# Altium schematic sheet Schematic.SchDoc
size A3
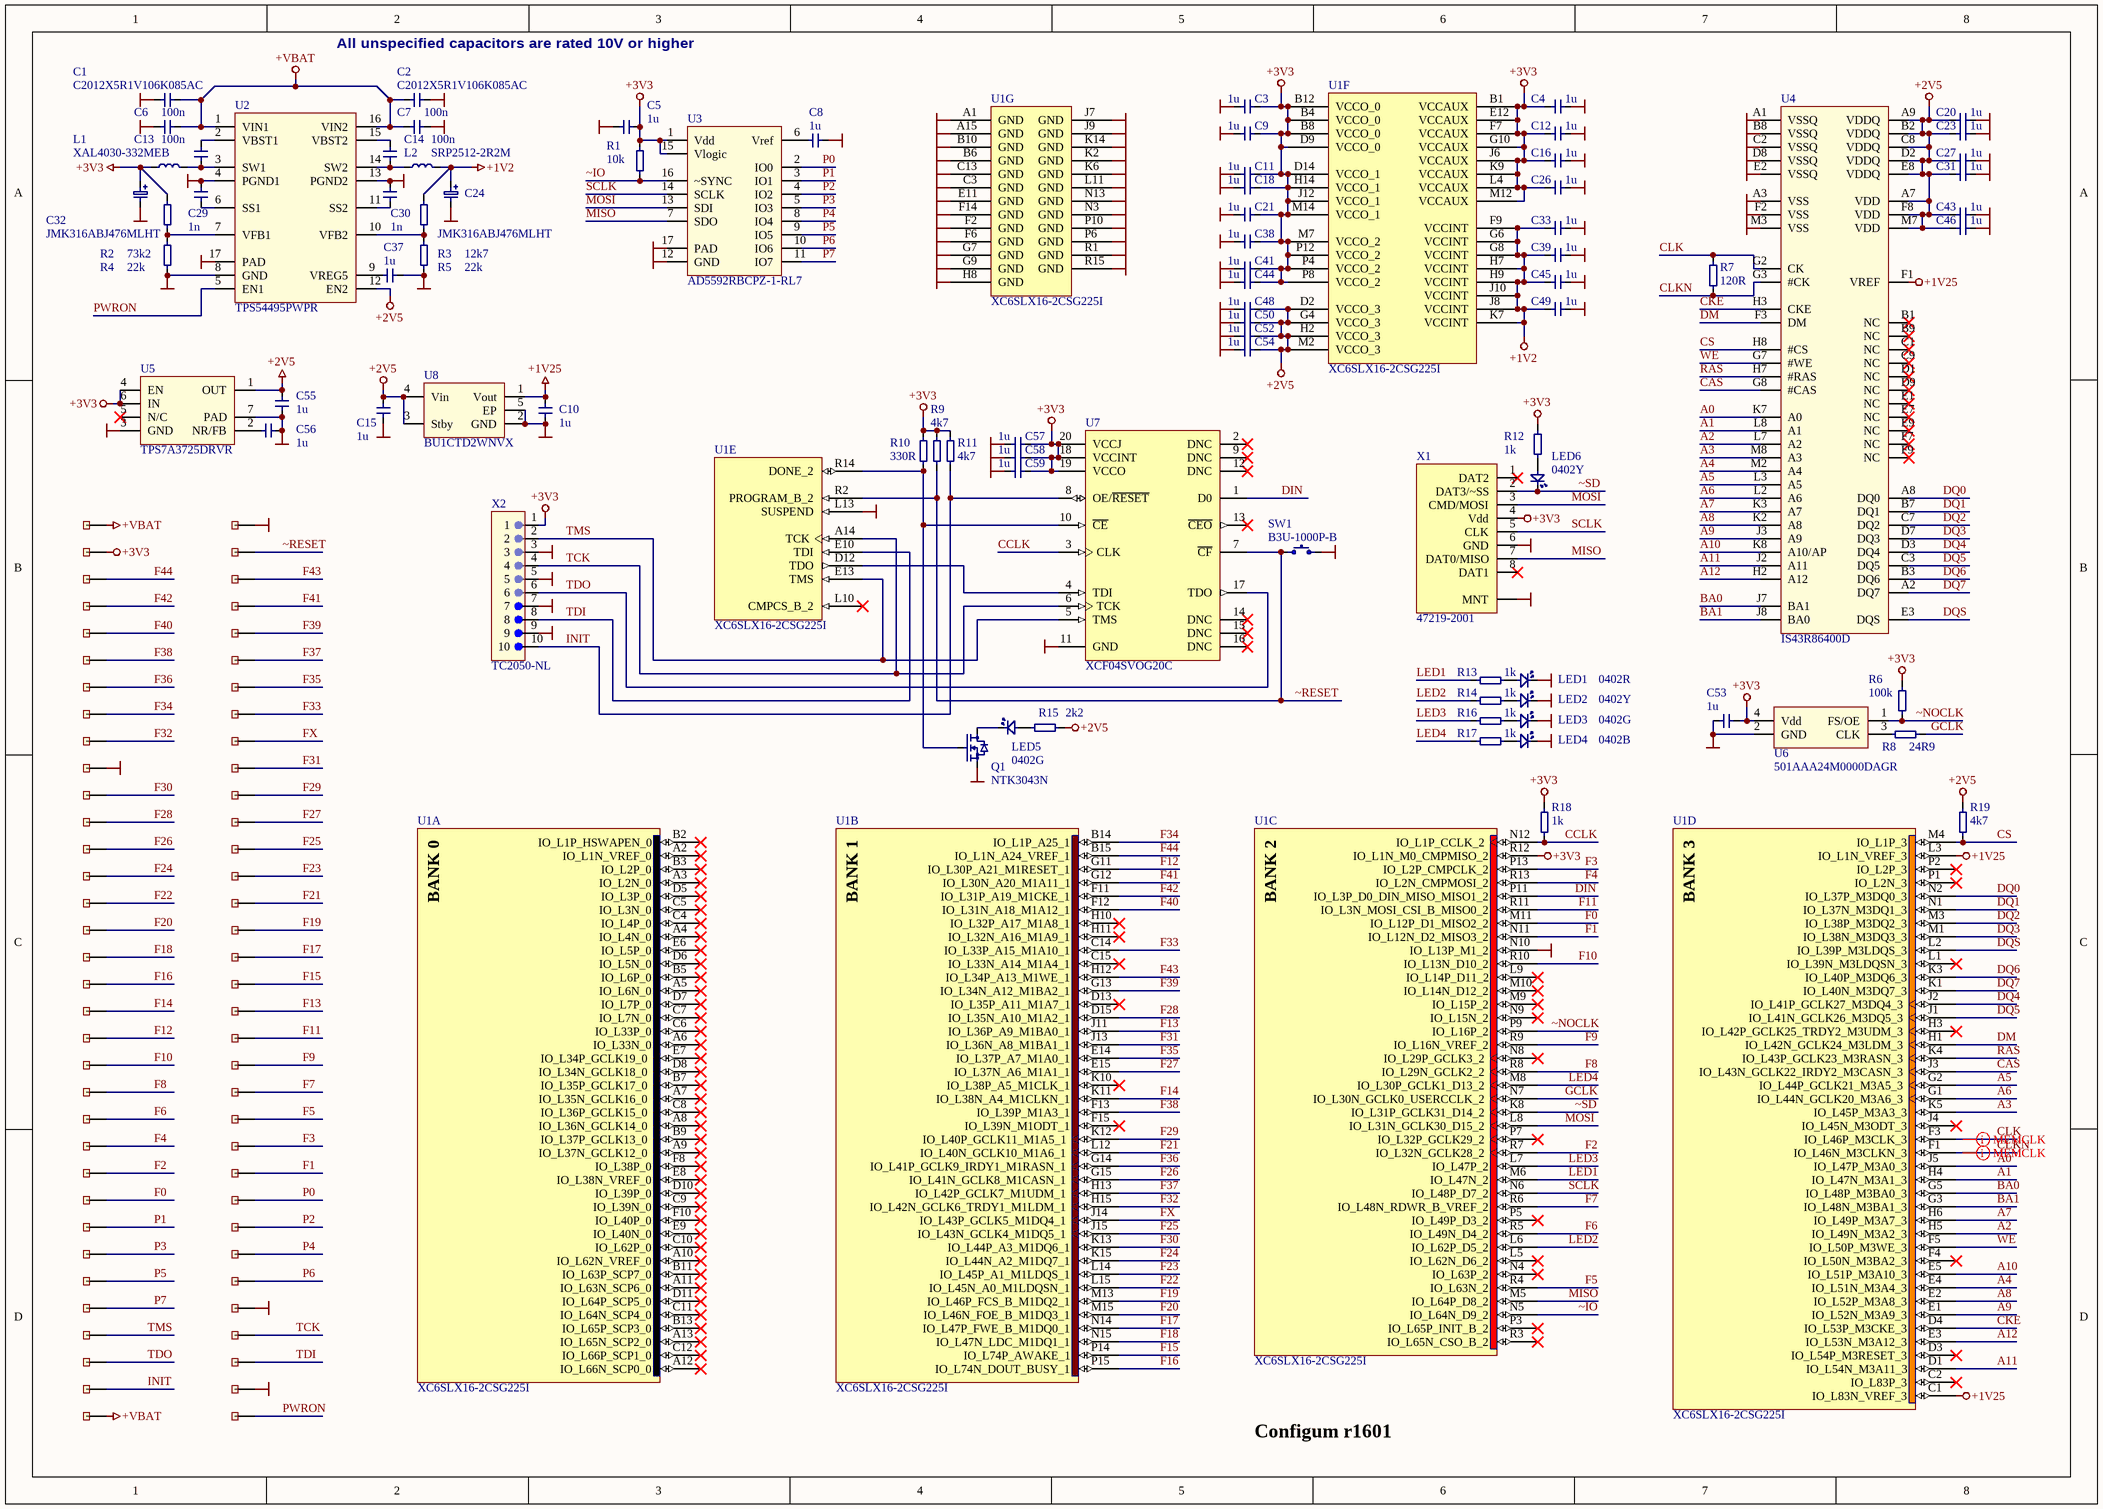
[diagram p0: Schematic.SchDoc]

## Parts
C1  C2012X5R1V106K085AC  [_0805]
C2  C2012X5R1V106K085AC  [_0805]
C3  1u  [_0402]
C4  1u  [_0402]
C5  1u  [_0402]
C6  100n  [_0402]
C7  100n  [_0402]
C8  1u  [_0402]
C9  1u  [_0402]
C10  1u  [_0402]
C11  1u  [_0402]
C12  1u  [_0402]
C13  100n  [_0402]
C14  100n  [_0402]
C15  1u  [_0402]
C16  1u  [_0402]
C18  1u  [_0402]
C20  1u  [_0402]
C21  1u  [_0402]
C23  1u  [_0402]
C24  JMK316ABJ476MLHT  [Case A (3216)]
C26  1u  [_0402]
C27  1u  [_0402]
C29  1n  [_0402]
C30  1n  [_0402]
C31  1u  [_0402]
C32  JMK316ABJ476MLHT  [Case A (3216)]
C33  1u  [_0402]
C37  1u  [_0402]
C38  1u  [_0402]
C39  1u  [_0402]
C41  1u  [_0402]
C43  1u  [_0402]
C44  1u  [_0402]
C45  1u  [_0402]
C46  1u  [_0402]
C48  1u  [_0402]
C49  1u  [_0402]
C50  1u  [_0402]
C52  1u  [_0402]
C53  1u  [_0402]
C54  1u  [_0402]
C55  1u  [_0402]
C56  1u  [_0402]
C57  1u  [_0402]
C58  1u  [_0402]
C59  1u  [_0402]
L1  XAL4030-332MEB  [IND_4X4]
L2  SRP2512-2R2M  [IND_2.5x2]
LED1  0402R  [_0402+]
LED2  0402Y  [_0402+]
LED3  0402G  [_0402+]
LED4  0402B  [_0402+]
LED5  0402G  [_0402+]
LED6  0402Y  [_0402+]
PIN1  Pin/Pad  [PLCC68 pin]  (value not drawn)  (no BOM)
PIN2  Pin/Pad  [PLCC68 pin]  (value not drawn)  (no BOM)
PIN3  Pin/Pad  [PLCC68 pin]  (value not drawn)  (no BOM)
PIN4  Pin/Pad  [PLCC68 pin]  (value not drawn)  (no BOM)
PIN5  Pin/Pad  [PLCC68 pin]  (value not drawn)  (no BOM)
PIN6  Pin/Pad  [PLCC68 pin]  (value not drawn)  (no BOM)
PIN7  Pin/Pad  [PLCC68 pin]  (value not drawn)  (no BOM)
PIN8  Pin/Pad  [PLCC68 pin]  (value not drawn)  (no BOM)
PIN9  Pin/Pad  [PLCC68 pin]  (value not drawn)  (no BOM)
PIN10  Pin/Pad  [PLCC68 pin]  (value not drawn)  (no BOM)
PIN11  Pin/Pad  [PLCC68 pin]  (value not drawn)  (no BOM)
PIN12  Pin/Pad  [PLCC68 pin]  (value not drawn)  (no BOM)
PIN13  Pin/Pad  [PLCC68 pin]  (value not drawn)  (no BOM)
PIN14  Pin/Pad  [PLCC68 pin]  (value not drawn)  (no BOM)
PIN15  Pin/Pad  [PLCC68 pin]  (value not drawn)  (no BOM)
PIN16  Pin/Pad  [PLCC68 pin]  (value not drawn)  (no BOM)
PIN17  Pin/Pad  [PLCC68 pin]  (value not drawn)  (no BOM)
PIN18  Pin/Pad  [PLCC68 pin]  (value not drawn)  (no BOM)
PIN19  Pin/Pad  [PLCC68 pin]  (value not drawn)  (no BOM)
PIN20  Pin/Pad  [PLCC68 pin]  (value not drawn)  (no BOM)
PIN21  Pin/Pad  [PLCC68 pin]  (value not drawn)  (no BOM)
PIN22  Pin/Pad  [PLCC68 pin]  (value not drawn)  (no BOM)
PIN23  Pin/Pad  [PLCC68 pin]  (value not drawn)  (no BOM)
PIN24  Pin/Pad  [PLCC68 pin]  (value not drawn)  (no BOM)
PIN25  Pin/Pad  [PLCC68 pin]  (value not drawn)  (no BOM)
PIN26  Pin/Pad  [PLCC68 pin]  (value not drawn)  (no BOM)
PIN27  Pin/Pad  [PLCC68 pin]  (value not drawn)  (no BOM)
PIN28  Pin/Pad  [PLCC68 pin]  (value not drawn)  (no BOM)
PIN29  Pin/Pad  [PLCC68 pin]  (value not drawn)  (no BOM)
PIN30  Pin/Pad  [PLCC68 pin]  (value not drawn)  (no BOM)
PIN31  Pin/Pad  [PLCC68 pin]  (value not drawn)  (no BOM)
PIN32  Pin/Pad  [PLCC68 pin]  (value not drawn)  (no BOM)
PIN33  Pin/Pad  [PLCC68 pin]  (value not drawn)  (no BOM)
PIN34  Pin/Pad  [PLCC68 pin]  (value not drawn)  (no BOM)
PIN35  Pin/Pad  [PLCC68 pin]  (value not drawn)  (no BOM)
PIN36  Pin/Pad  [PLCC68 pin]  (value not drawn)  (no BOM)
PIN37  Pin/Pad  [PLCC68 pin]  (value not drawn)  (no BOM)
PIN38  Pin/Pad  [PLCC68 pin]  (value not drawn)  (no BOM)
PIN39  Pin/Pad  [PLCC68 pin]  (value not drawn)  (no BOM)
PIN40  Pin/Pad  [PLCC68 pin]  (value not drawn)  (no BOM)
PIN41  Pin/Pad  [PLCC68 pin]  (value not drawn)  (no BOM)
PIN42  Pin/Pad  [PLCC68 pin]  (value not drawn)  (no BOM)
PIN43  Pin/Pad  [PLCC68 pin]  (value not drawn)  (no BOM)
PIN44  Pin/Pad  [PLCC68 pin]  (value not drawn)  (no BOM)
PIN45  Pin/Pad  [PLCC68 pin]  (value not drawn)  (no BOM)
PIN46  Pin/Pad  [PLCC68 pin]  (value not drawn)  (no BOM)
PIN47  Pin/Pad  [PLCC68 pin]  (value not drawn)  (no BOM)
PIN48  Pin/Pad  [PLCC68 pin]  (value not drawn)  (no BOM)
PIN49  Pin/Pad  [PLCC68 pin]  (value not drawn)  (no BOM)
PIN50  Pin/Pad  [PLCC68 pin]  (value not drawn)  (no BOM)
PIN51  Pin/Pad  [PLCC68 pin]  (value not drawn)  (no BOM)
PIN52  Pin/Pad  [PLCC68 pin]  (value not drawn)  (no BOM)
PIN53  Pin/Pad  [PLCC68 pin]  (value not drawn)  (no BOM)
PIN54  Pin/Pad  [PLCC68 pin]  (value not drawn)  (no BOM)
PIN55  Pin/Pad  [PLCC68 pin]  (value not drawn)  (no BOM)
PIN56  Pin/Pad  [PLCC68 pin]  (value not drawn)  (no BOM)
PIN57  Pin/Pad  [PLCC68 pin]  (value not drawn)  (no BOM)
PIN58  Pin/Pad  [PLCC68 pin]  (value not drawn)  (no BOM)
PIN59  Pin/Pad  [PLCC68 pin]  (value not drawn)  (no BOM)
PIN60  Pin/Pad  [PLCC68 pin]  (value not drawn)  (no BOM)
PIN61  Pin/Pad  [PLCC68 pin]  (value not drawn)  (no BOM)
PIN62  Pin/Pad  [PLCC68 pin]  (value not drawn)  (no BOM)
PIN63  Pin/Pad  [PLCC68 pin]  (value not drawn)  (no BOM)
PIN64  Pin/Pad  [PLCC68 pin]  (value not drawn)  (no BOM)
PIN65  Pin/Pad  [PLCC68 pin]  (value not drawn)  (no BOM)
PIN66  Pin/Pad  [PLCC68 pin]  (value not drawn)  (no BOM)
PIN67  Pin/Pad  [PLCC68 pin]  (value not drawn)  (no BOM)
PIN68  Pin/Pad  [PLCC68 pin]  (value not drawn)  (no BOM)
Q1  NTK3043N  [SC105-3]
R1  10k  [_0402]
R2  73k2  [_0402]
R3  12k7  [_0402]
R4  22k  [_0402]
R5  22k  [_0402]
R6  100k  [_0402]
R7  120R  [_0402]
R8  24R9  [_0402]
R9  4k7  [_0402]
R10  330R  [_0402]
R11  4k7  [_0402]
R12  1k  [_0402]
R13  1k  [_0402]
R14  1k  [_0402]
R15  2k2  [_0402]
R16  1k  [_0402]
R17  1k  [_0402]
R18  1k  [_0402]
R19  4k7  [_0402]
SW1  B3U-1000P-B  [B3U-1000P-B]
U1  XC6SLX16-2CSG225I  [CSG225]  (parts A,B,C,D,E,F,G of 7)
U2  TPS54495PWPR  [TSOP65P650X110_HS-16N]
U3  AD5592RBCPZ-1-RL7  [QFN50P300X300-16V4N]
U4  IS43R86400D  [BGA60C80P12X9_1300X800X120]
U5  TPS7A3725DRVR  [SON65P200x200_HS-6N]
U6  501AAA24M0000DAGR  [Osc 25x20 (4)]
U7  XCF04SVOG20C  [VOG20_L]
U8  BU1CTD2WNVX  [DFN65P100x100-4]
X1  47219-2001  [MOLEX_47219-2001]
X2  TC2050-NL  [TC2050-NL]  (no BOM)

## Nets
+1V2: C24.1 C33.1 C39.1 C45.1 C49.1 L2.1 R3.2 U1.F9(VCCINT) U1.G6(VCCINT) U1.G8(VCCINT) U1.H7(VCCINT) U1.H9(VCCINT) U1.J8(VCCINT) U1.J10(VCCINT) U1.K7(VCCINT)
+1V25: C10.2 U1.C1(IO_L83N_VREF_3) U1.L3(IO_L1N_VREF_3) U4.F1(VREF) U8.1(Vout)
+2V5: C15.2 C20.1 C23.1 C27.1 C31.1 C43.1 C46.1 C48.2 C50.2 C52.2 C54.2 C55.1 R15.2 R19.2 U1.D2(VCCO_3) U1.G4(VCCO_3) U1.H2(VCCO_3) U1.M2(VCCO_3) U2.12(EN2) U4.A7(VDD) U4.A9(VDDQ) U4.B2(VDDQ) U4.C8(VDDQ) U4.D2(VDDQ) U4.E8(VDDQ) U4.F8(VDD) U4.M7(VDD) U5.1(OUT) U8.3(Stby) U8.4(Vin)
+3V3: C3.2 C4.1 C5.2 C9.2 C11.2 C12.1 C16.1 C18.2 C21.2 C26.1 C32.1 C38.2 C41.2 C44.2 C53.1 C57.2 C58.2 C59.2 L1.1 PIN3.12 R1.1 R2.2 R6.1 R9.1 R10.1 R11.1 R12.1 R18.2 U1.B1(VCCAUX) U1.B4(VCCO_0) U1.B8(VCCO_0) U1.B12(VCCO_0) U1.D9(VCCO_0) U1.D14(VCCO_1) U1.E12(VCCAUX) U1.F7(VCCAUX) U1.G10(VCCAUX) U1.H14(VCCO_1) U1.J6(VCCAUX) U1.J12(VCCO_1) U1.K9(VCCAUX) U1.L4(VCCAUX) U1.M7(VCCO_2) U1.M12(VCCAUX) U1.M14(VCCO_1) U1.P4(VCCO_2) U1.P8(VCCO_2) U1.P12(VCCO_2) U1.R12(IO_L1N_M0_CMPMISO_2) U3.1(Vdd) U3.15(Vlogic) U5.4(EN) U5.6(IN) U6.4(Vdd) U7.18(VCCINT) U7.19(VCCO) U7.20(VCCJ) X1.4(Vdd) X2.1
+VBAT: C1.2 C2.1 C6.2 C7.1 PIN1.10 PIN67.8 U2.1(VIN1) U2.16(VIN2)
GND: C1.1 C2.2 C3.1 C4.2 C5.1 C6.1 C7.2 C8.2 C9.1 C10.1 C11.1 C12.2 C15.1 C16.2 C18.1 C20.2 C21.1 C23.2 C24.2 C26.2 C27.2 C29.1 C30.1 C31.2 C32.2 C33.2 C37.2 C38.1 C39.2 C41.1 C43.2 C44.1 C45.2 C46.2 C48.1 C49.2 C50.1 C52.1 C53.2 C54.1 C55.2 C56.1 C57.1 C58.1 C59.1 LED1.1 LED2.1 LED3.1 LED4.1 PIN2.11 PIN19.28 PIN60.1 PIN66.7 Q1.2(S) R4.1 R5.1 SW1.2 U1.A1(GND) U1.A15(GND) U1.B6(GND) U1.B10(GND) U1.C3(GND) U1.C13(GND) U1.E11(GND) U1.F2(GND) U1.F6(GND) U1.F14(GND) U1.G7(GND) U1.G9(GND) U1.H8(GND) U1.J7(GND) U1.J9(GND) U1.K2(GND) U1.K6(GND) U1.K14(GND) U1.L11(GND) U1.L13(SUSPEND) U1.N3(GND) U1.N10(IO_L13P_M1_2) U1.N13(GND) U1.P6(GND) U1.P10(GND) U1.R1(GND) U1.R15(GND) U2.4(PGND1) U2.8(GND) U2.13(PGND2) U2.17(PAD) U3.12(GND) U3.17(PAD) U4.A1(VSSQ) U4.A3(VSS) U4.B8(VSSQ) U4.C2(VSSQ) U4.D8(VSSQ) U4.E2(VSSQ) U4.F2(VSS) U4.M3(VSS) U5.3(GND) U5.7(PAD) U6.2(GND) U7.11(GND) U8.2(GND) U8.5(EP) X1.0(MNT) X1.6(GND) X2.3 X2.5 X2.7 X2.9
A0: U1.J5(IO_L47P_M3A0_3) U4.K7(A0)
A1: U1.H4(IO_L47N_M3A1_3) U4.L8(A1)
A2: U1.H5(IO_L49N_M3A2_3) U4.L7(A2)
A3: U1.K5(IO_L45P_M3A3_3) U4.M8(A3)
A4: U1.E4(IO_L51N_M3A4_3) U4.M2(A4)
A5: U1.G2(IO_L44P_GCLK21_M3A5_3) U4.L3(A5)
A6: U1.G1(IO_L44N_GCLK20_M3A6_3) U4.L2(A6)
A7: U1.H6(IO_L49P_M3A7_3) U4.K3(A7)
A8: U1.E2(IO_L52P_M3A8_3) U4.K2(A8)
A9: U1.E1(IO_L52N_M3A9_3) U4.J3(A9)
A10: U1.E5(IO_L51P_M3A10_3) U4.K8(A10/AP)
A11: U1.D1(IO_L54N_M3A11_3) U4.J2(A11)
A12: U1.E3(IO_L53N_M3A12_3) U4.H2(A12)
BA0: U1.G5(IO_L48P_M3BA0_3) U4.J7(BA1)
BA1: U1.G3(IO_L48N_M3BA1_3) U4.J8(BA0)
CAS: U1.J3(IO_L43N_GCLK22_IRDY2_M3CASN_3) U4.G8(#CAS)
CCLK: R18.1 U1.N12(IO_L1P_CCLK_2) U7.3(CLK)
CKE: U1.D4(IO_L53P_M3CKE_3) U4.H3(CKE)
CLK: R7.1 U1.F3(IO_L46P_M3CLK_3) U4.G2(CK)
CLKN: R7.2 U1.F1(IO_L46N_M3CLKN_3) U4.G3(#CK)
CS: R19.1 U1.M4(IO_L1P_3) U4.H8(#CS)
DIN: U1.P11(IO_L3P_D0_DIN_MISO_MISO1_2) U7.1(D0)
DM: U1.H1(IO_L42N_GCLK24_M3LDM_3) U4.F3(DM)
DQ0: U1.N2(IO_L37P_M3DQ0_3) U4.A8(DQ0)
DQ1: U1.N1(IO_L37N_M3DQ1_3) U4.B7(DQ1)
DQ2: U1.M3(IO_L38P_M3DQ2_3) U4.C7(DQ2)
DQ3: U1.M1(IO_L38N_M3DQ3_3) U4.D7(DQ3)
DQ4: U1.J2(IO_L41P_GCLK27_M3DQ4_3) U4.D3(DQ4)
DQ5: U1.J1(IO_L41N_GCLK26_M3DQ5_3) U4.C3(DQ5)
DQ6: U1.K3(IO_L40P_M3DQ6_3) U4.B3(DQ6)
DQ7: U1.K1(IO_L40N_M3DQ7_3) U4.A2(DQ7)
DQS: U1.L2(IO_L39P_M3LDQS_3) U4.E3(DQS)
F0: PIN51.60 U1.M11(IO_L12P_D1_MISO2_2)
F1: PIN50.59 U1.N11(IO_L12N_D2_MISO3_2)
F2: PIN49.58 U1.R7(IO_L32N_GCLK28_2)
F3: PIN48.57 U1.P13(IO_L2P_CMPCLK_2)
F4: PIN47.56 U1.R13(IO_L2N_CMPMOSI_2)
F5: PIN46.55 U1.R4(IO_L63N_2)
F6: PIN45.54 U1.R5(IO_L49N_D4_2)
F7: PIN44.53 U1.R6(IO_L48N_RDWR_B_VREF_2)
F8: PIN43.52 U1.R8(IO_L29N_GCLK2_2)
F9: PIN42.51 U1.R9(IO_L16N_VREF_2)
F10: PIN41.50 U1.R10(IO_L13N_D10_2)
F11: PIN40.49 U1.R11(IO_L3N_MOSI_CSI_B_MISO0_2)
F12: PIN39.48 U1.G11(IO_L30P_A21_M1RESET_1)
F13: PIN38.47 U1.J11(IO_L36P_A9_M1BA0_1)
F14: PIN37.46 U1.K11(IO_L38N_A4_M1CLKN_1)
F15: PIN36.45 U1.P14(IO_L74P_AWAKE_1)
F16: PIN35.44 U1.P15(IO_L74N_DOUT_BUSY_1)
F17: PIN34.43 U1.N14(IO_L47P_FWE_B_M1DQ0_1)
F18: PIN33.42 U1.N15(IO_L47N_LDC_M1DQ1_1)
F19: PIN32.41 U1.M13(IO_L46P_FCS_B_M1DQ2_1)
F20: PIN31.40 U1.M15(IO_L46N_FOE_B_M1DQ3_1)
F21: PIN30.39 U1.L12(IO_L40N_GCLK10_M1A6_1)
F22: PIN29.38 U1.L15(IO_L45N_A0_M1LDQSN_1)
F23: PIN28.37 U1.L14(IO_L45P_A1_M1LDQS_1)
F24: PIN27.36 U1.K15(IO_L44N_A2_M1DQ7_1)
F25: PIN26.35 U1.J15(IO_L43N_GCLK4_M1DQ5_1)
F26: PIN25.34 U1.G15(IO_L41N_GCLK8_M1CASN_1)
F27: PIN24.33 U1.E15(IO_L37N_A6_M1A1_1)
F28: PIN23.32 U1.D15(IO_L35N_A10_M1A2_1)
F29: PIN22.31 U1.K12(IO_L40P_GCLK11_M1A5_1)
F30: PIN21.30 U1.K13(IO_L44P_A3_M1DQ6_1)
F31: PIN20.29 U1.J13(IO_L36N_A8_M1BA1_1)
F32: PIN17.26 U1.H15(IO_L42N_GCLK6_TRDY1_M1LDM_1)
F33: PIN16.25 U1.C14(IO_L33P_A15_M1A10_1)
F34: PIN15.24 U1.B14(IO_L1P_A25_1)
F35: PIN14.23 U1.E14(IO_L37P_A7_M1A0_1)
F36: PIN13.22 U1.G14(IO_L41P_GCLK9_IRDY1_M1RASN_1)
F37: PIN12.21 U1.H13(IO_L42P_GCLK7_M1UDM_1)
F38: PIN11.20 U1.F13(IO_L39P_M1A3_1)
F39: PIN10.19 U1.G13(IO_L34N_A12_M1BA2_1)
F40: PIN9.18 U1.F12(IO_L31N_A18_M1A12_1)
F41: PIN8.17 U1.G12(IO_L30N_A20_M1A11_1)
F42: PIN7.16 U1.F11(IO_L31P_A19_M1CKE_1)
F43: PIN6.15 U1.H12(IO_L34P_A13_M1WE_1)
F44: PIN5.14 U1.B15(IO_L1N_A24_VREF_1)
FX: PIN18.27 U1.J14(IO_L43P_GCLK5_M1DQ4_1)
GCLK: R8.2 U1.N7(IO_L30N_GCLK0_USERCCLK_2)
INIT: PIN65.6 R11.2 U7.8(OE/~{RESET}) X2.10
LED1: R13.2 U1.M6(IO_L47N_2)
LED2: R14.2 U1.L6(IO_L62P_D5_2)
LED3: R16.2 U1.L7(IO_L47P_2)
LED4: R17.2 U1.M8(IO_L30P_GCLK1_D13_2)
MISO: U1.M5(IO_L64P_D8_2) U3.7(SDO) X1.7(DAT0/MISO)
MOSI: U1.L8(IO_L31N_GCLK30_D15_2) U3.13(SDI) X1.3(CMD/MOSI)
P0: PIN52.61 U3.2(IO0)
P1: PIN53.62 U3.3(IO1)
P2: PIN54.63 U3.4(IO2)
P3: PIN55.64 U3.5(IO3)
P4: PIN56.65 U3.8(IO4)
P5: PIN57.66 U3.9(IO5)
P6: PIN58.67 U3.10(IO6)
P7: PIN59.68 U3.11(IO7)
PWRON: PIN68.9 U2.5(EN1)
RAS: U1.K4(IO_L43P_GCLK23_M3RASN_3) U4.H7(#RAS)
SCLK: U1.N6(IO_L48P_D7_2) U3.14(SCLK) X1.5(CLK)
TCK: PIN62.3 U1.A14(TCK) U7.6(TCK) X2.4
TDI: PIN64.5 U1.E10(TDI) X2.8
TDO: PIN63.4 U7.17(TDO) X2.6
TMS: PIN61.2 U1.E13(TMS) U7.5(TMS) X2.2
WE: U1.F5(IO_L50P_M3WE_3) U4.G7(#WE)
~IO: R1.2 U1.N5(IO_L64N_D9_2) U3.16(~SYNC)
~NOCLK: R6.2 U1.P9(IO_L16P_2) U6.1(FS/OE)
~RESET: PIN4.13 R9.2 SW1.1 U1.R2(PROGRAM_B_2) U7.7(~{CF})
~SD: LED6.1 U1.K8(IO_L31P_GCLK31_D14_2) X1.2(DAT3/~SS)
NetC8_1: C8.1 U3.6(Vref)
NetC13_1: C13.1 L1.2 U2.3(SW1)
NetC13_2: C13.2 U2.2(VBST1)
NetC14_1: C14.1 L2.2 U2.14(SW2)
NetC14_2: C14.2 U2.15(VBST2)
NetC29_2: C29.2 U2.6(SS1)
NetC30_2: C30.2 U2.11(SS2)
NetC37_1: C37.1 U2.9(VREG5)
NetC56_2: C56.2 U5.2(NR/FB)
NetLED1_2: LED1.2 R13.1
NetLED2_2: LED2.2 R14.1
NetLED3_2: LED3.2 R16.1
NetLED4_2: LED4.2 R17.1
NetLED5_1: LED5.1 Q1.3(D)
NetLED5_2: LED5.2 R15.1
NetLED6_2: LED6.2 R12.2
NetQ1_1: Q1.1(G) R10.2 U1.R14(DONE_2) U7.10(~{CE})
NetR2_1: R2.1 R4.2 U2.7(VFB1)
NetR3_1: R3.1 R5.2 U2.10(VFB2)
NetR8_1: R8.1 U6.3(CLK)
NetU1_D12: U1.D12(TDO) U7.4(TDI)

Not connected (* = marked no-connect by the designer): U1 A2(IO_L1N_VREF_0)* A3(IO_L2N_0)* A4(IO_L4N_0)* A5(IO_L6N_0)* A6(IO_L33N_0)* A7(IO_L35N_GCLK16_0)* A8(IO_L36N_GCLK14_0)* A9(IO_L37N_GCLK12_0)* A10(IO_L62N_VREF_0)* A11(IO_L63N_SCP6_0)* A12(IO_L66N_SCP0_0)* A13(IO_L65N_SCP2_0)* B2(IO_L1P_HSWAPEN_0)* B3(IO_L2P_0)* B5(IO_L6P_0)* B7(IO_L35P_GCLK17_0)* B9(IO_L37P_GCLK13_0)* B11(IO_L63P_SCP7_0)* B13(IO_L65P_SCP3_0)* C2(IO_L83P_3)* C4(IO_L4P_0)* C5(IO_L3N_0)* C6(IO_L33P_0)* C7(IO_L7N_0)* C8(IO_L36P_GCLK15_0)* C9(IO_L39N_0)* C10(IO_L62P_0)* C11(IO_L64N_SCP4_0)* C12(IO_L66P_SCP1_0)* C15(IO_L33N_A14_M1A4_1)* D3(IO_L54P_M3RESET_3)* D5(IO_L3P_0)* D6(IO_L5N_0)* D7(IO_L7P_0)* D8(IO_L34N_GCLK18_0)* D10(IO_L39P_0)* D11(IO_L64P_SCP5_0)* D13(IO_L35P_A11_M1A7_1)* E6(IO_L5P_0)* E7(IO_L34P_GCLK19_0)* E8(IO_L38N_VREF_0)* E9(IO_L40N_0)* F4(IO_L50N_M3BA2_3)* F8(IO_L38P_0)* F10(IO_L40P_0)* F15(IO_L39N_M1ODT_1)* H3(IO_L42P_GCLK25_TRDY2_M3UDM_3)* H10(IO_L32P_A17_M1A8_1)* H11(IO_L32N_A16_M1A9_1)* J4(IO_L45N_M3ODT_3)* K10(IO_L38P_A5_M1CLK_1)* L1(IO_L39N_M3LDQSN_3)* L5(IO_L62N_D6_2)* L9(IO_L14P_D11_2)* L10(CMPCS_B_2)* M9(IO_L15P_2)* M10(IO_L14N_D12_2)* N4(IO_L63P_2)* N8(IO_L29P_GCLK3_2)* N9(IO_L15N_2)* P1(IO_L2N_3)* P2(IO_L2P_3)* P3(IO_L65P_INIT_B_2)* P5(IO_L49P_D3_2)* P7(IO_L32P_GCLK29_2)* R3(IO_L65N_CSO_B_2)*; U4 B1(NC)* B9(NC)* C1(NC)* C9(NC)* D1(NC)* D9(NC)* E1(NC)* E7(NC)* E9(NC)* F7(NC)* F9(NC)*; U5 5(N/C)*; U7 2(DNC)* 9(DNC)* 12(DNC)* 13(~{CEO})* 14(DNC)* 15(DNC)* 16(DNC)*; X1 1(DAT2)* 8(DAT1)*

## Layout directives
differential pair: CLK, CLKN

## Notes on the sheet
- All unspecified capacitors are rated 10V or higher
- Configum r1601
- (in symbol XC6SLX16-2CSG225I, part A) BANK 0
- (in symbol XC6SLX16-2CSG225I, part B) BANK 1
- (in symbol XC6SLX16-2CSG225I, part C) BANK 2
- (in symbol XC6SLX16-2CSG225I, part D) BANK 3

## Library data of the parts
C1-C16 C18 C20 C21 C23 C26 C27 C29-C31 C33 C37-C39 C41 C43-C46 C48-C50 C52-C59 = Capacitor
C24 C32 = Capacitor+: Polar capacitor
L1 L2 = Inductor
LED1-LED6 = LED: Light Emitting Diode
  LED6: Digikey: 511-1654-1-ND
PIN1-PIN68 = Pin/Pad: Single pin/pad
Q1 = N-FET: N-channel FET transistor
R1-R19 = Resistor
  R1 R6-R19: Digikey: RMCF0402FT3K30CT-ND
SW1 = Switch MNO SPST: Switch, Momentary, Normal Open, SPST
U1 = XC6SLX16-2CSG225I: Spartan-6 LX 1.2V FPGA, 160 User I/Os, 225-Ball Chip-Scale BGA (0.8mm Pitch), Speed Grade 2, Industrial Grade, Pb-Free; DatasheetVersion: ver1.6, Nov-2010; PackageVersion: ver1.1, Nov-2009; PackageReference: CSG225; PackageDescription: 225-Ball Chip-Scale BGA (CSG225) Package, 0.8 mm Pitch; Code_JEDEC: MO-275-HHAC-1; ComponentLink1Description: Manufacturer URL; ComponentLink1URL: http://www.xilinx.com/; ComponentLink2Description: Spartan-6 Datasheet; ComponentLink2URL: http://www.xilinx.com/support/documentation/data_sheets/ds160.pdf; ComponentLink3Description: Spartan-6 Documents; ComponentLink3URL: http://www.xilinx.com/support/documentation/spartan-6.htm
U2 = TPS54495 TSSOP16: 4A/2A Dual Channel Synchronous Step-Down Switcher with Integrated FET; Manufacturer: Texas Instruments
U3 = AD5592R-1 QFN16: 8-Channel, 12-Bit, Configurable ADC/DAC with On-Chip Reference, SPI Interface; Manufacturer: Analog Devices
U4 = IS43R86400D FBGA60: 64Mx8 DDR SDRAM; Manufacturer: ISSI; Option: IS43R86400D (64Mx8); IS43R16320D (32Mx16); IS43R32160D (16Mx32)
U5 = TPS7A37: 1% High-Accuracy, 1-A, Low-Dropout Regulator  with Reverse Current Protection; Manufacturer: Texas Instruments; Option: 3701 (adj); 3721 (2.1V); 3725 (2.5V)
U6 = Si50x: 32kHz –100MHz CMEMS Oscillator; Manufacturer: Silicon Labs; Option: Si501 (one frequency); Option: Si502 (dual selectable frequency); Option: Si503 (quad selectable frequency)
U7 = XCF04SVOG20C: XCF00S Series, Platform Flash In-System Programmable Configuration 3.3V PROM, 20-Pin TSOP, 4-Megabit, Commercial Grade, Pb-Free; DatasheetVersion: ver2.17, Oct-2009; PackageVersion: ver1.3, Dec-2008; PackageReference: VOG20; PackageDescription: 20-Pin Thin Shrink Small Outline Package (VOG20) - Pb-Free; Code_JEDEC: MO-153-AC; ComponentLink1Description: Manufacturer URL; ComponentLink1URL: http://www.xilinx.com/; ComponentLink2Description: Platform Flash Datasheet; ComponentLink2URL: http://www.xilinx.com/support/documentation/data_sheets/ds123.pdf; ComponentLink3Description: VOG20 Package Drawing; ComponentLink3URL: http://www.xilinx.com/support/documentation/package_specs/vo20.pdf; ComponentLink4Description: Configuration PROM Documents; ComponentLink4URL: http://www.xilinx.com/support/documentation/configuration_proms.htm
U8 = BUxxTD2WNVX: 1.25V 200mA LDO in 1mm x 1mm package; Manufacturer: Rohm
X1 = microSD: microSD card connector
X2 = TC2050: TC2050 nails connector; Manufacturer: www.tag-connect.com